# Altium schematic sheet main.SchDoc
size A3
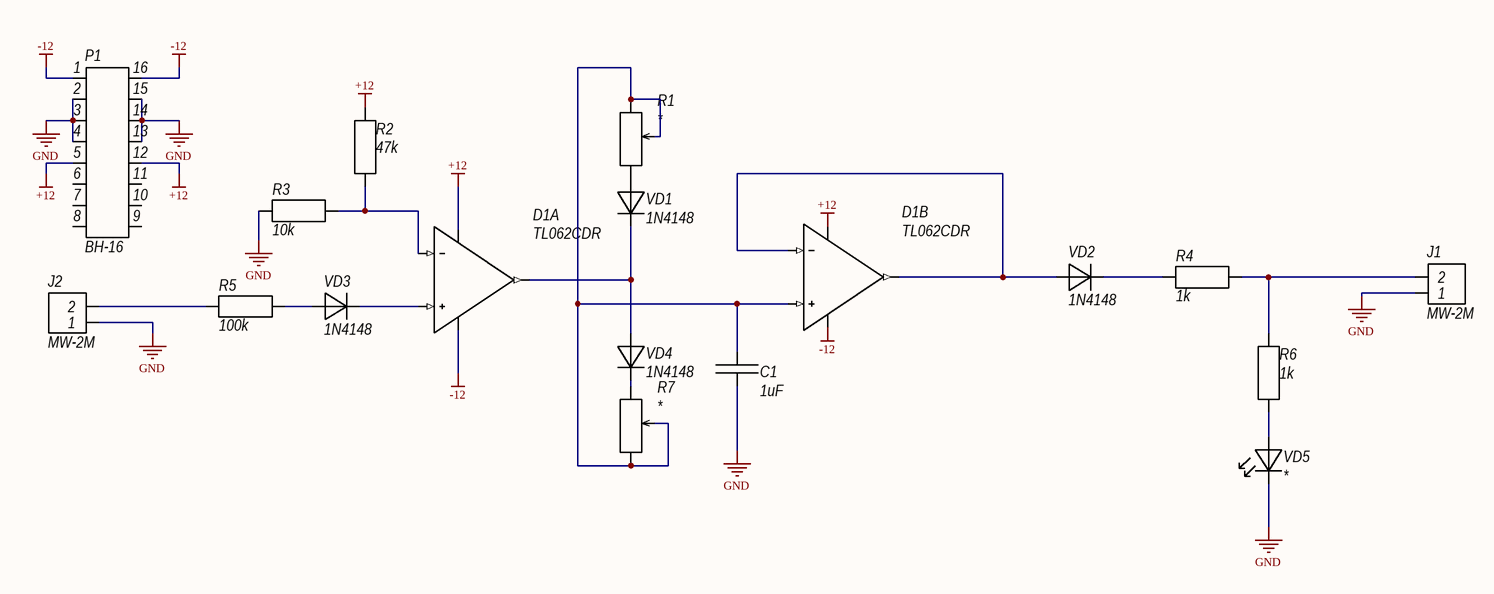
[diagram p0: main.SchDoc]

## Parts
C1  1uF  [CAP DISK 5mm]
D1  TL062CDR  [DIP-8]  (parts A,B of 2)
J1  MW-2M  [MW-2M]
J2  MW-2M  [MW-2M]
P1  BH-16  [BH-16]
R1  *  [WF-3]
R2  47k  [R1206]
R3  10k  [R1206]
R4  1k  [R1206]
R5  100k  [R1206]
R6  1k  [R1206]
R7  *  [potentiometr hor]
VD1  1N4148  [SOD-123]
VD2  1N4148  [SOD-123]
VD3  1N4148  [SOD-123]
VD4  1N4148  [SOD-123]
VD5  *  [LED-5mm]

## Nets
+12: D1.8(Vcc+) P1.5 P1.12 R2.2
-12: D1.4(Vcc-) P1.1 P1.16
GND: C1.1 J1.1 J2.1 P1.2 P1.3 P1.4 P1.13 P1.14 P1.15 R3.1 VD5.2
NetC1_2: C1.2 D1.5(21IN+) R1.1 R1.2 R7.2 R7.3
NetD1_1: D1.1(1OUT) VD1.2 VD4.1
NetD1_2: D1.2(1IN-) R2.1 R3.2
NetD1_3: D1.3(1IN+) VD3.2
NetD1_6: D1.6(2IN-) D1.7(2OUT) VD2.1
NetJ1_2: J1.2 R4.2 R6.2
NetJ2_2: J2.2 R5.1
NetR1_3: R1.3 VD1.1
NetR4_1: R4.1 VD2.2
NetR5_2: R5.2 VD3.1
NetR6_1: R6.1 VD5.1
NetR7_1: R7.1 VD4.2

Not connected (* = marked no-connect by the designer): P1 6 7 8 9 10 11

## Library data of the parts
C1 = Capacitor: Model: *; Case: *; HelpURL: *; Manufacturer: *; Value: *
D1 = TL062: Manufacturer: Texas Instruments; HelpURL: https://www.digikey.com/product-detail/en/texas-instruments/TL062CDR/296-1281-1-ND/276549; Case: 8SOIC; Model: TL062CDR
R1 R7 = Potentiometr: Case: *; HelpURL: *; Manufacturer: *; Model: *; Value: *
R2-R6 = Resistor: Model: *; Manufacturer: *; HelpURL: *; Case: *; Value: *
VD1-VD4 = 1N4148W-E3-18: DIODE GEN PURP 75V 150MA; Manufacturer: Vishay Semiconductor Diodes Division; HelpURL: https://www.digikey.com/product-detail/en/vishay-semiconductor-diodes-division/1N4148W-E3-18/1N4148W-E3-18TR-ND/3104163; Model: 1N4148; Case: SOD123
VD5 = LED: Model: *
J1 J2 = MW-2M: Model: MW-2M
P1 = BH-16: HelpURL: *; Manufacturer: *; Model: BH-16